# EAGLE design MinieasyMySens-V02-Build006 (EAGLE 7.6.0)
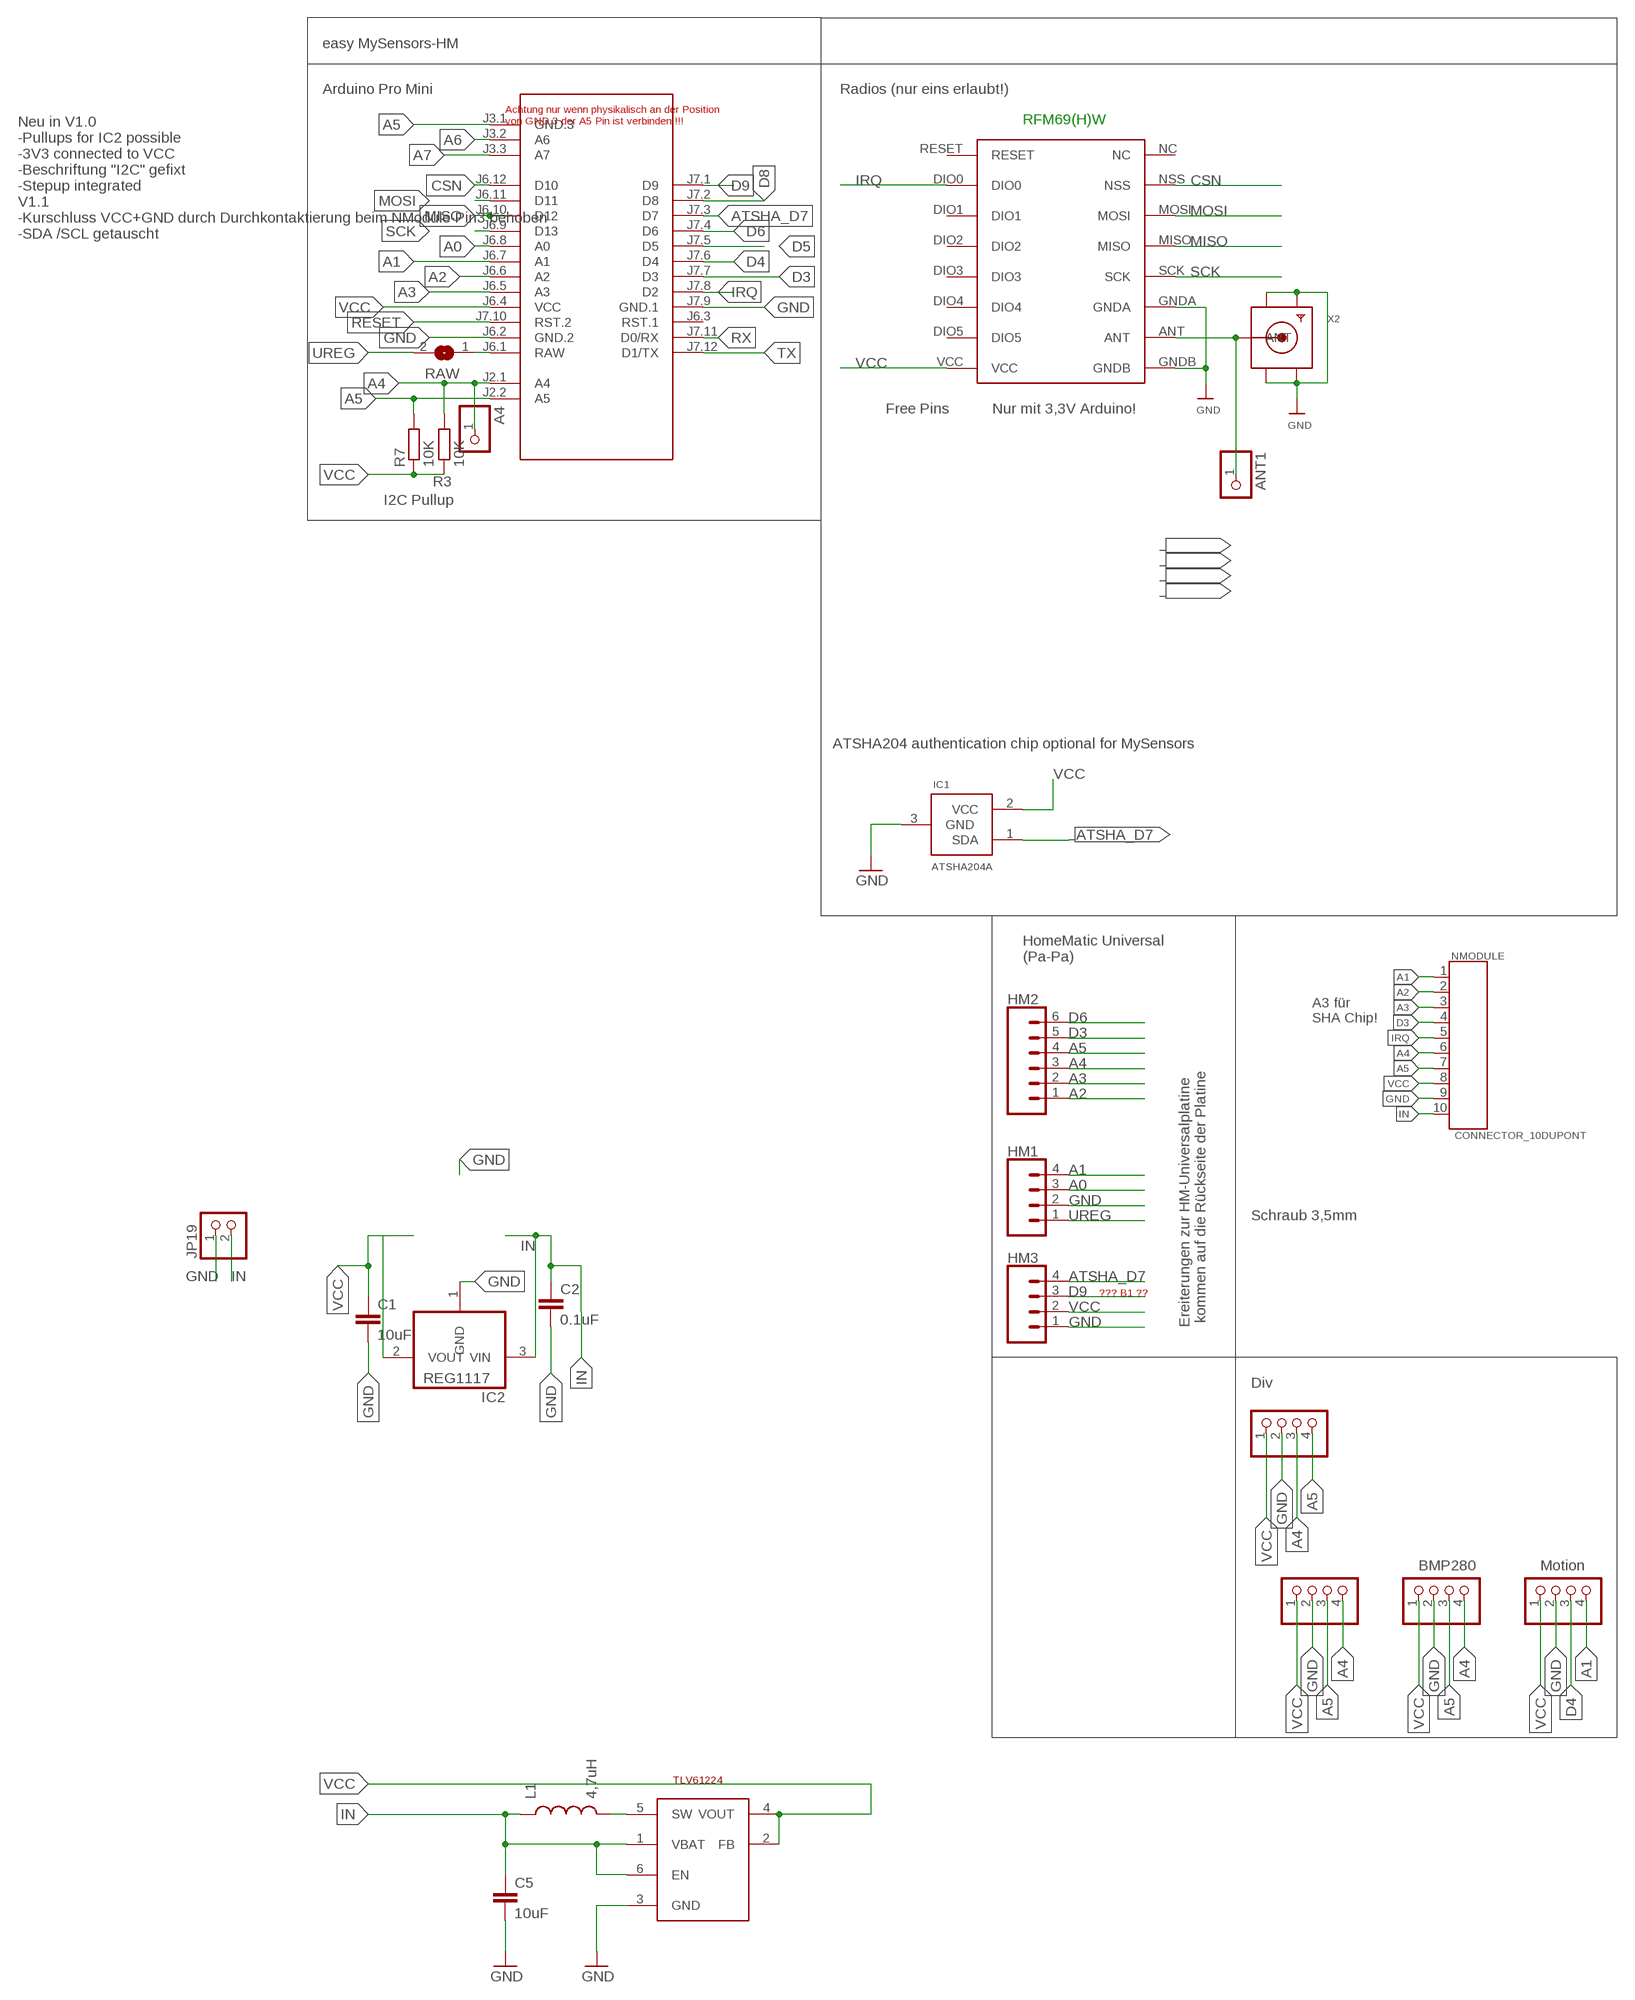
[diagram p0: schematic, sheet 1]

## Parts
A4  PINHD-1X1  [1X01]
ANT1  PINHD-1X1  [1X01]
BH1750  PINHD-1X04_2.54-S  [1X04-S]
C1  10uF  C-EUC1210  [C1210]
C2  0.1uF  C-EUC1206  [C1206]
C5  10uF  CAP0805  [0805]
HM1  CONN_04  [1X04]
HM2  CONN_06SILK_FEMALE_PTH  [1X06]
HM3  CONN_04  [1X04]
I2C-1  PINHD-1X04_2.54-S  [1X04-S]
I2C-2  PINHD-1X04_2.54-S  [1X04-S]
IC1  ATSHA204A  [SOT23]
IC2  REG1117  [SOT223]
JP19  PINHD-1X2  [1X02]
L1  4,7uH  INDUCTOR0805  [0805]
M1  ARDUINO-PRO-MINI-3.3V#NP  [ARDUINO-PRO-MINI#NP]
MOTION  PINHD-1X04_2.54-S  [1X04-S]
NMODULE  CONNECTOR_10DUPONT  [DUPONT_10]
R3  10K  R-EU_R0805  [R0805]
R7  10K  R-EU_R0805  [R0805]
RAW  SJ  [SJ]
RFM69W  RFM69HW  [RFM]
STEPUP  TLV61224  TI-TLV61224  [SOT23-6L]
X2  SMACONNECTOR_EDGE  [SMA_EDGELAUNCH]

## Nets
A0: HM1.3 M1.J6.8(A0)
A1: HM1.4 M1.J6.7(A1) MOTION.4 NMODULE.1
A2: HM2.1 M1.J6.6(A2) NMODULE.2
A3: HM2.2 M1.J6.5(A3) NMODULE.3
A4: A4.1 BH1750.4 HM2.3 I2C-1.4 I2C-2.3 M1.J2.1(A4) NMODULE.6 R3.2
A5: BH1750.3 HM2.4 I2C-1.3 I2C-2.4 M1.J2.2(A5) M1.J3.1(GND.3) NMODULE.7 R7.2
A6: M1.J3.2(A6)
A7: M1.J3.3(A7)
ATSHA_D7: HM3.4 IC1.1(SDA) M1.J7.3(D7)
CSN: M1.J6.12(D10) RFM69W.NSS
D3: HM2.5 M1.J7.7(D3) NMODULE.4
D4: M1.J7.6(D4) MOTION.3
D5: M1.J7.5(D5)
D6: HM2.6 M1.J7.4(D6)
D8: M1.J7.2(D8)
D9: HM3.3 M1.J7.1(D9)
GND [Power]: BH1750.2 C1.2 C2.2 C5.2 HM1.2 HM3.1 I2C-1.2 I2C-2.2 IC1.3(GND) IC2.1(GND) JP19.1 M1.J6.2(GND.2) M1.J7.9(GND.1) MOTION.2 NMODULE.9 RFM69W.GNDA RFM69W.GNDB STEPUP.3(GND) X2.GND@1(GND4) X2.GND@2(GND3) X2.GND@3(GND2) X2.GND@4(GND1)
IN [Power]: C2.1 C5.1 IC2.3(VIN) JP19.2 L1.1 NMODULE.10 STEPUP.1(VBAT) STEPUP.6(EN)
IRQ: M1.J7.8(D2) NMODULE.5 RFM69W.DIO0
MISO: M1.J6.10(D12) RFM69W.MISO
MOSI: M1.J6.11(D11) RFM69W.MOSI
N$13: L1.2 STEPUP.5(SW)
N$16: ANT1.1 RFM69W.ANT X2.P(ANT)
RAW [Power]: M1.J6.1(RAW) RAW.1
RESET: M1.J7.10(RST.2)
RX: M1.J7.11(D0/RX)
SCK: M1.J6.9(D13) RFM69W.SCK
TX: M1.J7.12(D1/TX)
UREG [Power]: HM1.1 RAW.2
VCC [Power]: BH1750.1 C1.1 HM3.2 I2C-1.1 I2C-2.1 IC1.2(VCC) IC2.2(VOUT) M1.J6.4(VCC) MOTION.1 NMODULE.8 R3.1 R7.1 RFM69W.VCC STEPUP.2(FB) STEPUP.4(VOUT)
Unconnected: M1.J6.3(RST.1) RFM69W.DIO1 RFM69W.DIO2 RFM69W.DIO3 RFM69W.DIO4 RFM69W.DIO5 RFM69W.NC RFM69W.RESET

## Notes on the sheet
- easy MySensors-HM
- Arduino Pro Mini | Radios (nur eins erlaubt!)
- Achtung nur wenn physikalisch an der Position 
  von GND.3 der A5 Pin ist verbinden !!!
- RFM69(H)W
- Neu in V1.0
  -Pullups for IC2 possible
  -3V3 connected to VCC
  -Beschriftung "I2C" gefixt
  -Stepup integrated
  V1.1
  -Kurschluss VCC+GND durch Durchkontaktierung beim NModule-Pin3 behoben
  -SDA /SCL getauscht
- Free Pins | Nur mit 3,3V Arduino!
- I2C Pullup
- ATSHA204 authentication chip optional for MySensors
- HomeMatic Universal
  (Pa-Pa)
- A3 für 
  SHA Chip!
- Schraub 3,5mm
- ??? B1 ??
- Ereiterungen zur HM-Universalplatine
   kommen auf die Rückseite der Platine
- Div
- BMP280 | Motion

## Library data of the parts
A4 ANT1 = pinhead:PINHD-1X1: PIN HEADER
BH1750 I2C-1 I2C-2 MOTION = pinhead-2:PINHD-1X04: PIN HEADER
C1 C2 = rcl:C-EU: CAPACITOR, European symbol
C5 = SparkFun-Passives:CAP: Capacitor Standard 0603 ceramic capacitor, and 0.1" leaded capacitor.
HM1 HM3 = SparkFun-Connectors:CONN_04: Multi connection point. Often used as Generic Header-pin footprint for 0.1 inch spaced/style header connections On any of the 0.1 inch spaced packages, you can populate with these: Break Away Headers - Straight <https://www.sparkfun.com/products/116> (PRT-00116) Break Away Male Headers - Right Angle <https://www.sparkfun.com/products/553> (PRT-00553) Female Headers <https://www.sparkfun.com/products/115> (PRT-00115) Break Away Headers - Machine Pin <https://www.sparkfun.com/products/117> (PRT-00117) Break Away Female Headers - Swiss Machine Pin <https://www.sparkfun.com/products/743> (PRT-00743) For SCREWTERMINALS and SPRING TERMINALS visit here: Screw Terimnals on SparkFun.com <https://www.sparkfun.com/search/results?term=Screw+Terminals> (5mm/3.5mm/2.54mm spacing) This device is also useful as a general connection point to wire up your design to another part of your project. Our various solder wires solder well into these plated through hole pads. Hook-Up Wire - Assortment (Stranded, 22 AWG) <https://www.sparkfun.com/products/11375> (PRT-11375) Hook-Up Wire - Assortment (Solid Core, 22 AWG) <https://www.sparkfun.com/products/11367> (PRT-11367) View the entire wire category on our website here <https://www.sparkfun.com/categories/141> Special notes: Molex polarized connector foot print use with SKU : PRT-08231 with associated crimp pins and housings. 1MM SMD Version SKU: PRT-10208; PROD_ID: CONN-09696
HM2 = SparkFun-Connectors:CONN_06: Multi connection point. Often used as Generic Header-pin footprint for 0.1 inch spaced/style header connections On any of the 0.1 inch spaced packages, you can populate with these: Break Away Headers - Straight <https://www.sparkfun.com/products/116> (PRT-00116) Break Away Male Headers - Right Angle <https://www.sparkfun.com/products/553> (PRT-00553) Female Headers <https://www.sparkfun.com/products/115> (PRT-00115) Break Away Headers - Machine Pin <https://www.sparkfun.com/products/117> (PRT-00117) Break Away Female Headers - Swiss Machine Pin <https://www.sparkfun.com/products/743> (PRT-00743) Arduino Stackable Header - 6 Pin <https://www.sparkfun.com/products/9280> (PRT-09280) For SCREWTERMINALS and SPRING TERMINALS visit here: Screw Terimnals on SparkFun.com <https://www.sparkfun.com/search/results?term=Screw+Terminals> (5mm/3.5mm/2.54mm spacing) This device is also useful as a general connection point to wire up your design to another part of your project. Our various solder wires solder well into these plated through hole pads. Hook-Up Wire - Assortment (Stranded, 22 AWG) <https://www.sparkfun.com/products/11375> (PRT-11375) Hook-Up Wire - Assortment (Solid Core, 22 AWG) <https://www.sparkfun.com/products/11367> (PRT-11367) View the entire wire category on our website here <https://www.sparkfun.com/categories/141>; PROD_ID: CONN-08437
IC1 = Sensor:ATSHA204A
IC2 = burr-brown:REG1117: 800mA and 1A Low Dropout (LDO) Positive Regulator 1.8V, 2.5V, 2.85V, 3.3V, 5V, and Adj; MPN: REG1117; OC_FARNELL: 1097566; OC_NEWARK: 14P6981
JP19 = pinhead:PINHD-1X2: PIN HEADER
L1 = SparkFun-Passives:INDUCTOR: Inductors Basic Inductor/Choke - 0603 and 1206. Footprints are not proven and vary greatly between part numbers.
M1 = diy-modules:ARDUINO-PRO-MINI-*#NP: Arduino Pro Mini without programming pads
NMODULE = TD-MySensors:CONNECTOR_10
R3 R7 = rcl:R-EU_: RESISTOR, European symbol
RAW = jumper:SJ: SMD solder JUMPER
RFM69W = hoperf:RFM69HW
STEPUP = TLV61224:TI-TLV61224
X2 = adafruit:SMACONNECTOR: SMA Connector 90° DIP SMA Connector, 50 Ohm (4UConnector: 07259)

## Net classes
0 default: width 0.305 mm
1 Power: width 0.508 mm

## Board
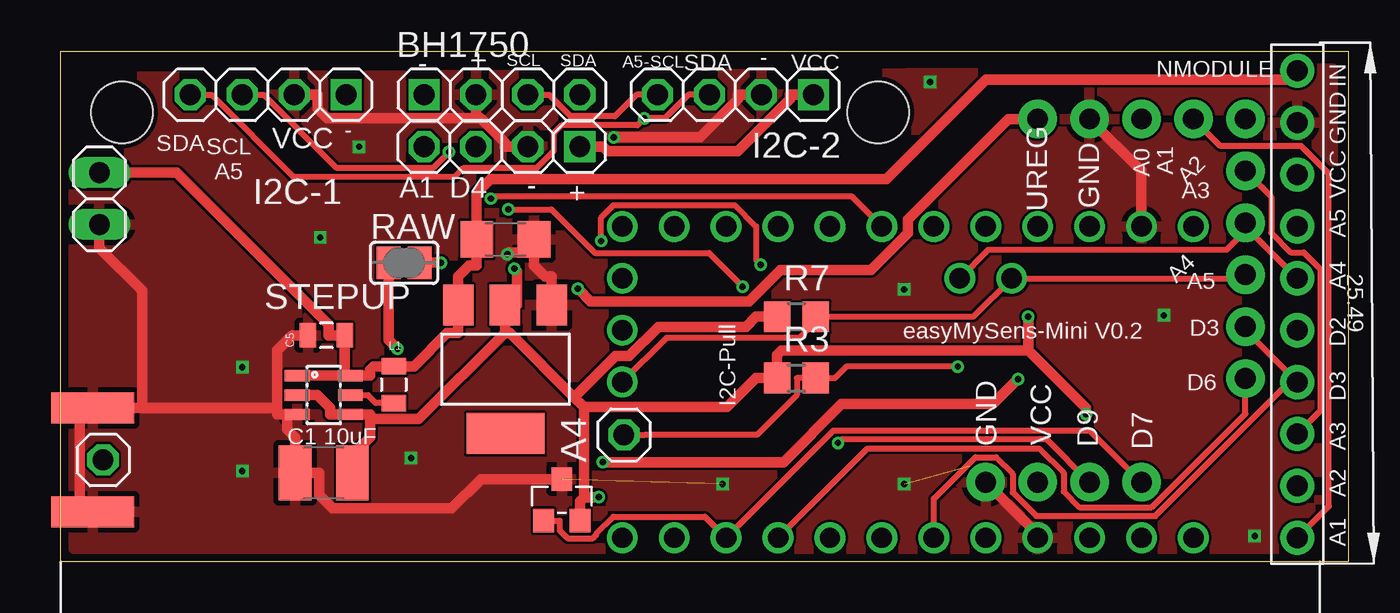
[diagram p1: board, top side]
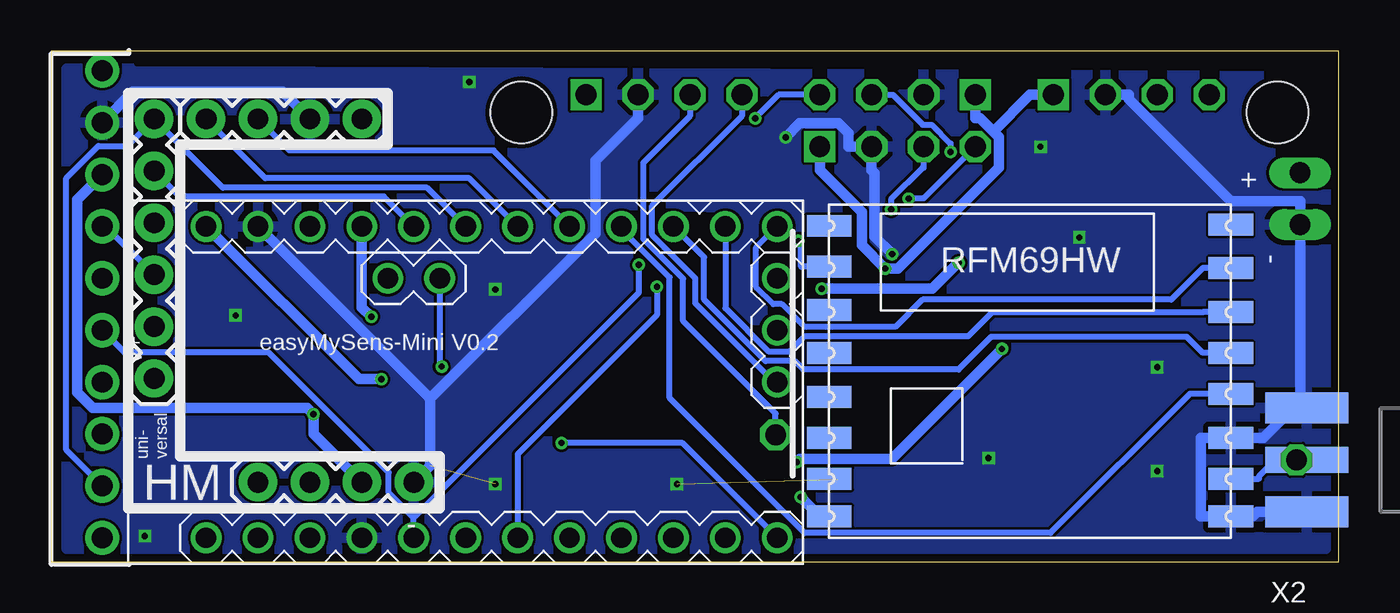
[diagram p2: board, bottom side, seen from below]

Size 63 x 25 mm. Coordinates in mm from the lower left corner, seen from the top.
Outline: 63,0 0,0 0,25 63,25 63,0
Copper layers (1*16): Top 0.035mm / dielectric 1.5mm / Bottom 0.035mm
Design rules "dirt_cheap_dirty_boards.v1": minimum track width 5mil, minimum drill 12mil, track to track 5mil, track to pad 5mil, pad to pad 5mil, via to via 5mil, smd to smd 0mil, copper to edge 10mil, drill to drill 10mil, minimum pad ring 10mil, minimum via ring 6mil, stop-mask expansion 2mil, vias tented up to drill 25mil, thermal gap 10mil
Holes 3 mm at 3,22 40,22
tRestrict: area 0,24.1 to 59.1,25.4; 2 lines
bRestrict: area 0,24.1 to 58.8,25.4; 2 lines

### Footprints (pad centres in the part's own frame; a part is rotated, then mirrored left to right if it is on the bottom)
1X01 = drill 1.016 octagon: 1 0,0
1X04-S = drill 1.016 square: 1 -3.81,0 | drill 1.016 octagon: 2 -1.27,0; 3 1.27,0; 4 3.81,0
C1210 = smd 1.6 x 2.7: 1 -1.4,0; 2 1.4,0
C1206 = smd 1.6 x 1.8: 1 -1.4,0; 2 1.4,0
0805 = smd 0.8 x 1.2: 1 -0.9,0; 2 0.9,0
1X04 = drill 1.016 pad 1.88: 1 0,0; 2 2.54,0; 3 5.08,0; 4 7.62,0
1X06 = drill 1.016 pad 1.88: 1 0,0; 2 2.54,0; 3 5.08,0; 4 7.62,0; 5 10.16,0; 6 12.7,0
SOT23 = smd 1.016 x 1.143: 1 -0.889,-1.016; 2 0.889,-1.016; 3 0,1.016
SOT223 = smd 1.499 x 2.007: 1 -2.261,-3.15; 2 0.025,-3.15; 3 2.311,-3.15 | smd 3.81 x 2.007: 4 0,3.15
1X02 = drill 1.016 long: 1 -1.27,0; 2 1.27,0
ARDUINO-PRO-MINI#NP = drill 1: J2.1 -1.27,5.08; J2.2 -3.81,5.08; J3.1 15.24,0; J3.2 15.24,2.54; J3.3 15.24,5.08; J6.1 -12.7,7.62; J6.2 -10.16,7.62; J6.3 -7.62,7.62; J6.4 -5.08,7.62; J6.5 -2.54,7.62; J6.6 0,7.62; J6.7 2.54,7.62; J6.8 5.08,7.62; J6.9 7.62,7.62; J6.10 10.16,7.62; J6.11 12.7,7.62; J6.12 15.24,7.62; J7.1 15.24,-7.62; J7.2 12.7,-7.62; J7.3 10.16,-7.62; J7.4 7.62,-7.62; J7.5 5.08,-7.62; J7.6 2.54,-7.62; J7.7 0,-7.62; J7.8 -2.54,-7.62; J7.9 -5.08,-7.62; J7.10 -7.62,-7.62; J7.11 -10.16,-7.62; J7.12 -12.7,-7.62
DUPONT_10 = drill 1.016 pad 1.676: 1 1.27,1.27; 2 3.81,1.27; 3 6.35,1.27; 4 8.89,1.27; 5 11.43,1.27; 6 13.97,1.27; 7 16.51,1.27; 8 19.05,1.27; 9 21.59,1.27; 10 24.13,1.27
R0805 = smd 1.3 x 1.5: 1 -0.95,0; 2 0.95,0
SJ = smd 1.168 x 1.6: 1 -0.762,0; 2 0.762,0
RFM = smd 2.184 x 1.067: ANT 19.651,2.889; DIO0 0,13.27; DIO1 0,11.143; DIO2 0,9.047; DIO3 0,6.889; DIO4 0,4.889; DIO5 0,2.889; GNDA 19.651,4.889; GNDB 19.651,1.048; MISO 19.651,9.047; MOSI 19.651,11.047; NC 19.651,15.334; NSS 19.651,13.206; RESET 0,15.27; SCK 19.651,7.048; VCC 0,1.048
SOT23-6L = smd 0.55 x 1.2: 1 -0.95,-1.3; 2 0,-1.3; 3 0.95,-1.3; 4 0.95,1.3; 5 0,1.3; 6 -0.95,1.3
SMA_EDGELAUNCH = smd 4.064 x 1.524: GND@1 2.032,-2.54; GND@2 2.032,2.54 | smd 4.064 x 1.524 bottom: GND@3 2.032,2.54; GND@4 2.032,-2.54 | smd 4.064 x 1.27: P 2.032,0

### Placement (x,y rotation side)
A4  27.56,6.22 90 top
ANT1  2.08,4.99 0 top
BH1750  21.59,22.86 0 top
C1  12.88,4.36 180 top
C2  21.77,15.79 0 top
C5  13,11.09 180 top
HM1  47.8,21.68 180 bottom
HM2  57.96,21.68 270 bottom
HM3  45.26,3.9 180 bottom
I2C-1  10.16,22.86 180 top
I2C-2  33.02,22.86 180 top
IC1  24.52,3.04 0 top
IC2  21.77,9.44 180 top
JP19  1.91,17.78 90 top
L1  16.3,8.67 270 top
M1  42.72,8.8 0 bottom
MOTION  21.59,20.32 180 top
NMODULE  61.77,-0.09 90 top
R3  36,9 0 top
R7  36,12 0 top
RAW  16.81,14.64 0 top
RFM69W  24.94,1.18 0 bottom
STEPUP  12.88,8.16 270 top
X2  -0.46,4.99 180 bottom

### Tracks (layer width: path | path; a pad name or v marks a point on that pad's centre or on a via)
A0
  Bottom 0.305: M1.J6.8 41.35,20.13 51.33,20.13 HM1.3
A1  (via drill 0.3 pad 0.61)
  Top 0.305: M1.J6.7 38.71,17.89 21.16,17.89 v21.05,17.78 | NMODULE.1 62.05,2.73 62.05,19 60.69,20.36 56.74,20.36 HM1.4
  Bottom 0.305: MOTION.4 20.32,17.78 v21.05,17.78 | M1.J6.7 42.54,18.78 52.52,18.78 HM1.4
A2
  Bottom 0.305: M1.J6.6 44.62,18.32 54.6,18.32 HM2.1 59.28,20.36 60.68,20.36 62.25,18.79 62.25,5.47 NMODULE.2
A3
  Top 0.305: HM2.2 59.22,17.88 59.22,16.11 60.19,15.15 60.81,15.15 61.62,14.34 61.62,7.38 NMODULE.3
  Bottom 0.305: M1.J6.5 46.73,17.89 56.7,17.89 HM2.2
A4  (via drill 0.3 pad 0.61)
  Top 0.305: I2C-1.4 7.39,22.86 11.41,18.84 19.27,18.84 19.7,19.26 23.28,19.26 24.13,20.11 24.13,20.98 24.52,21.37 28.22,21.37 v28.56,21.71 29.56,21.71 30.71,22.86 I2C-2.3 | v43.9,9.56 38.44,9.56 37.88,9 R3.2 36.48,9 36.02,9 36.02,8.17 34.07,6.22 28.6,6.22 A4.1 | 57.96,16.19 58.19,16.19 NMODULE.6 | M1.J2.1 45.39,15.28 57.05,15.28 57.96,16.19 | 57.96,16.19 HM2.3
  Bottom 0.305: BH1750.4 27.41,22.86 v28.56,21.71 | I2C-2.3 31.75,21.82 34.03,19.54 34.03,15.81 32.08,13.86 32.08,11.78 27.56,7.26 A4.1 | M1.J2.1 43.99,9.65 v43.9,9.56
A5  (via drill 0.3 pad 0.61)
  Top 0.305: 37.18,12 36.15,10.97 29.65,10.97 M1.J3.1 | 37.18,12 37.88,12 44.65,12 M1.J2.2 57.78,13.88 HM2.4 | R7.2 37.18,12 | BH1750.3 23.9,22.86 24.95,21.82 27.12,21.82 28.17,22.86 I2C-2.4 | v19,20.06 18.22,19.28 13.51,19.28 9.93,22.86 I2C-1.3
  Bottom 0.305: I2C-2.4 29.21,21.82 33.6,17.43 33.6,15.99 31.48,13.88 31.48,12.66 27.63,8.8 M1.J3.1 | v19,20.06 19,20.48 19.93,21.4 20.36,21.4 21.82,22.86 BH1750.3 | HM2.4 60.32,16.42 NMODULE.7
ATSHA_D7
  Top 0.305: HM3.4 50.36,6.42 37.8,6.42 M1.J7.3 31.52,2.22 27.05,2.22 26.2,1.37 26.2,1.32 26.04,1.17 24.79,1.17 24.42,1.53 24.42,2.02 IC1.1
CSN
  Bottom 0.305: RFM69W.NSS 6.66,14.39 8.21,12.84 20.37,12.84 21.7,11.51 26.15,11.51 27.25,12.61 27.67,12.61 28.51,13.45 28.51,15.39 M1.J6.12
D3
  Top 0.305: M1.J7.7 42.72,3.09 44.76,5.12 45.77,5.12 46.58,4.31 46.58,3.4 47.73,2.25 53.56,2.25 60.31,8.99 | 60.31,8.99 57.96,11.34 HM2.5 | NMODULE.4 60.31,8.99
D4  (via drill 0.3 pad 0.61)
  Top 0.305: v21.91,17.25 24.01,17.25 26.14,15.12 31.72,15.12 v33.36,13.47
  Bottom 0.305: MOTION.3 20.32,19.28 20.39,19.28 21.91,17.75 v21.91,17.25 | v33.36,13.47 33.36,12.08 40.18,5.26 M1.J7.6
D6
  Top 0.305: M1.J7.4 39.47,5.55 47.87,5.55 49.07,4.36 49.07,3.44 49.84,2.68 53.38,2.68 57.96,7.25 HM2.6
D9  (via drill 0.3 pad 0.61)
  Top 0.305: HM3.3 48.25,5.99 38.2,5.99 v38.03,5.82
  Bottom 0.305: M1.J7.1 32.12,5.82 v38.03,5.82
GND  (via drill 0.3 pad 0.61)  (2 unrouted)
  Top 0.508: v27.06,20.78 31.29,20.78 33.15,22.64 33.15,22.86 I2C-2.2 | MOTION.2 21.72,20.32 21.72,20.54 20.54,21.72 20.32,21.72 | 11.09,7.21 11.09,6.48 11.47,6.09 C1.2 12.66,4.36 12.66,3.29 13.32,2.62 19.14,2.62 20.56,4.05 IC1.3 | 11.09,7.21 10.59,7.21 10.59,7.53 | STEPUP.3 11.09,7.21 | 10.59,7.53 10.59,10.35 11.32,11.09 C5.2 | 3.98,7.53 10.59,7.53 | 23.16,15.14 21.94,15.14 v21.85,15.06 | JP19.1 1.91,15.37 3.98,13.29 3.98,7.53 | 3.98,7.53 X2.GND@1 0.93,6.89 0.93,3.09 X2.GND@3 | HM3.1 47.8,1.36 M1.J7.9 | M1.J6.2 52.88,19.14 HM1.2 | IC2.1 24.03,12.79 24.03,13.97 23.7,13.97 23.16,14.5 23.16,15.14 | C2.2 23.16,15.14 | I2C-1.2 12.57,22.86 12.57,22.19 13.05,21.72 20.32,21.72 | BH1750.2 20.32,21.72
  Bottom 0.508: 44.45,7.99 44.45,4.71 HM3.1 | M1.J6.2 44.45,7.99 | 44.45,7.99 36.37,16.07 36.37,19.64 34.29,21.72 I2C-2.2 | v27.06,20.78 26.38,21.46 24.48,21.46 24,20.99 24,20.32 MOTION.2 22.86,19.75 22.86,19.18 22.71,19.03 22.71,15.92 v21.85,15.06 | 1.91,7.86 3.7,6.07 RFM69W.GNDA 6.76,6.07 6.76,2.23 RFM69W.GNDB 4.21,2.23 3.98,2.45 X2.GND@3 | 1.91,7.86 JP19.1 1.91,17.65 5.3,17.65 10.29,22.64 10.29,22.86 I2C-1.2 | 1.91,7.86 X2.GND@1 | NMODULE.9 59,23 51.66,23 HM1.2
  other vias: 12.7,15.88 8.89,9.53 8.89,4.45 17.14,5.08 32.38,3.81 53.98,12.06 42.55,23.5 14.61,20.32 41.27,3.81 58.42,1.27 41.27,13.34
  pour Top: 0.64,0.64 0.64,24.13 62.23,24.13 62.23,0.64
  pour Bottom: 0.64,0.64 0.64,24.13 62.23,24.13 62.23,0.64
IN
  Top 0.508: JP19.2 5.68,19.05 13.12,11.61 13.12,11.09 C5.1 13.9,9.12 | NMODULE.10 60.07,23.61 45.27,23.61 40.4,18.73 21.04,18.73 20.36,18.06 20.36,17.07 20.36,15.83 C2.1 20.36,14.5 19.99,14.5 19.45,13.97 IC2.3 19.45,11.2 18.91,11.2 17.29,9.57 L1.1 15.32,9.57 15.16,9.41 15.16,9.12 STEPUP.6 13.9,9.12 | STEPUP.1 13.9,9.12
IRQ  (via drill 0.3 pad 0.61)
  Top 0.305: v26.44,15.71 26.44,16.85 27.05,17.45 32.99,17.45 34.02,16.42 34.02,14.76 v34.25,14.54
  Bottom 0.305: 45.26,2.17 34.25,13.18 v34.25,14.54 | v26.44,15.71 26.31,15.58 26.31,14.45 RFM69W.DIO0 | 45.26,2.17 46.48,3.39 46.48,4.37 52.35,10.25 59.41,10.25 NMODULE.5 | M1.J7.8 45.26,2.17
MISO
  Bottom 0.305: RFM69W.MISO 6.66,10.23 7.45,11.01 17.02,11.01 18.61,9.41 26.2,9.41 26.62,9.83 28.05,9.83 31.05,12.84 31.05,14.91 M1.J6.10
MOSI
  Bottom 0.305: RFM69W.MOSI 6.66,12.23 16.95,12.23 18.13,11.05 26.15,11.05 26.89,10.3 27.91,10.3 30.02,12.41 M1.J6.11
N$13
  Top 0.305: STEPUP.5 15.05,8.16 15.05,8.14 15.43,7.77 L1.2
N$16
  Bottom 0.305: X2.P ANT1.1 3.12,4.99 3.92,4.19 3.92,4.07 RFM69W.ANT
RAW  (via drill 0.3 pad 0.61)
  Top 0.508: v26.52,4.88 35.37,4.88 38.21,7.73 45.62,7.73 v46.84,8.94 | RAW.1 16.05,10.86 v16.48,10.43
  Bottom 0.508: v46.84,8.94 47.94,8.94 M1.J6.1 | v16.48,10.43 21.87,5.04 26.36,5.04 v26.52,4.88
SCK
  Bottom 0.305: RFM69W.SCK 7.29,8.23 14.11,1.41 26.15,1.41 32.75,8.01 32.75,13.92 35.1,16.27 M1.J6.9
UREG  (via drill 0.3 pad 0.61)
  Top 0.508: v25.3,13.37 25.93,12.74 33.67,12.74 35.22,14.28 39.65,14.28 41.45,16.08 41.45,16.76 46.37,21.68 HM1.1 | v18.61,14.64 18.54,14.64 RAW.2
  Bottom 0.508: v25.3,13.37 19.88,13.37 v18.61,14.64
VCC  (via drill 0.3 pad 0.61)
  Top 0.508: I2C-2.1 35.69,22.86 35.69,22.64 33.15,20.09 26.77,20.09 26.54,20.32 MOTION.1 | 25.13,8.06 25.61,7.58 | 25.13,8.06 27.14,10.07 27.82,10.07 29.25,11.51 33.53,11.51 34.02,12 R7.1 | 25.13,8.06 21.99,11.2 21.74,11.2 | 15.16,6.99 15.16,6.1 14.28,5.22 C1.1 | 15.16,6.99 15.16,7.21 STEPUP.4 13.19,7.21 13.19,7.53 12.56,8.16 STEPUP.2 | 15.16,6.99 17.53,6.99 21.74,11.2 | 21.74,11.2 IC2.2 22.34,12.59 22.34,14.22 v22.2,14.36 | 47.34,10.36 35.28,10.36 35.05,10.13 R3.1 34.02,9 32.6,7.58 25.61,7.58 | 25.61,7.58 25.61,3.17 | 25.61,3.17 25.41,2.97 IC1.2 | v26.33,3.17 25.61,3.17 | v50.17,7.23 50.17,7.53 47.34,10.36 | 47.34,10.36 v47.34,12
  Bottom 0.508: 16.91,21.07 16.64,20.8 16.64,19.3 21.58,14.36 v22.2,14.36 23.35,15.5 23.35,17.12 25.4,19.18 MOTION.1 | RFM69W.VCC 25.39,2.23 v26.33,3.17 | M1.J6.4 47.8,12.46 v47.34,12 | 16.91,21.07 17.56,21.72 17.78,21.72 BH1750.1 | 16.91,21.07 15.11,22.86 I2C-1.1 | NMODULE.8 61.72,17.74 61.72,8.29 60.96,7.53 50.47,7.53 v50.17,7.23 50.17,6.27 HM3.2

### Text on the board
tPlace: easyMySens-Mini V0.2 | I2C-Pull
bPlace: easyMySens-Mini V0.2 | HM | uni- / versal
tNames: - | + | SCL | SDA | SDA | A5-SCL | - | VCC | IN | - | UREG | GND | SDA | SCL / A5 | VCC | A0 | A1 | GND | A1 | D4 | - | + | A3 | A2 | VCC | A5 | A4 | A5 | A4 | D3 | D2 | D6 | D3 | C1 10uF | GND | VCC | D9 | D7 | A3 | A2 | A1 | +
bNames: + | - | V+ | -